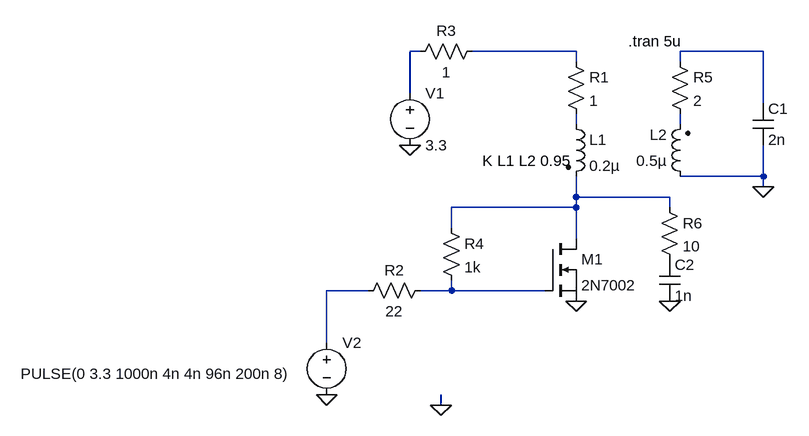
[diagram p0: schematic coupled-antenna-v1.asc]
coupled-antenna-v1.asc, the LTspice schematic file:
Version 4
SHEET 1 1060 752
WIRE 208 112 192 112
WIRE 448 112 288 112
WIRE 736 112 608 112
WIRE 448 128 448 112
WIRE 608 128 608 112
WIRE 192 176 192 112
WIRE 736 192 736 112
WIRE 448 224 448 208
WIRE 608 224 608 208
WIRE 736 304 736 256
WIRE 736 304 608 304
WIRE 736 320 736 304
WIRE 448 336 448 304
WIRE 592 336 448 336
WIRE 448 352 448 336
WIRE 448 352 256 352
WIRE 592 352 592 336
WIRE 256 384 256 352
WIRE 448 400 448 352
WIRE 128 480 64 480
WIRE 256 480 256 464
WIRE 256 480 208 480
WIRE 400 480 256 480
WIRE 64 560 64 480
WIRE 240 656 240 640
FLAG 192 256 0
FLAG 448 496 0
FLAG 64 640 0
FLAG 240 656 0
FLAG 736 320 0
FLAG 592 496 0
SYMBOL voltage 192 160 R0
SYMATTR InstName V1
SYMATTR Value 3.3
SYMBOL ind2 432 208 R0
SYMATTR InstName L1
SYMATTR Value 0.2µ
SYMATTR Type ind
SYMBOL ind2 624 320 R180
WINDOW 0 36 80 Left 2
WINDOW 3 36 40 Left 2
SYMATTR InstName L2
SYMATTR Value 0.5µ
SYMATTR Type ind
SYMBOL cap 720 192 R0
SYMATTR InstName C1
SYMATTR Value 2n
SYMBOL voltage 64 544 R0
WINDOW 3 -471 64 Left 2
SYMATTR Value PULSE(0 3.3 1000n 4n 4n 96n 200n 8)
SYMATTR InstName V2
SYMBOL res 432 112 R0
SYMATTR InstName R1
SYMATTR Value 1
SYMBOL nmos 400 400 R0
SYMATTR InstName M1
SYMATTR Value 2N7002
SYMBOL res 224 464 R90
WINDOW 0 0 56 VBottom 2
WINDOW 3 32 56 VTop 2
SYMATTR InstName R2
SYMATTR Value 22
SYMBOL res 304 96 R90
WINDOW 0 0 56 VBottom 2
WINDOW 3 32 56 VTop 2
SYMATTR InstName R3
SYMATTR Value 1
SYMBOL res 240 368 R0
SYMATTR InstName R4
SYMATTR Value 1k
SYMBOL res 592 112 R0
SYMATTR InstName R5
SYMATTR Value 2
SYMBOL cap 576 432 R0
SYMATTR InstName C2
SYMATTR Value 1n
SYMBOL res 576 336 R0
SYMATTR InstName R6
SYMATTR Value 10
TEXT 304 280 Left 2 !K L1 L2 0.95
TEXT 528 96 Left 2 !.tran 5u

The netlist it stands for:
* coupled-antenna-v1.asc
V1 N001 0 3.3
L1 N004 N006 0.2µ
L2 0 N005 0.5µ
C1 N003 0 2n
V2 N007 0 PULSE(0 3.3 1000n 4n 4n 96n 200n 8)
R1 N002 N004 1
M1 N006 N008 0 0 2N7002
R2 N008 N007 22
R3 N002 N001 1
R4 N006 N008 1k
R5 N003 N005 2
C2 P001 0 1n
R6 N006 P001 10
.model NMOS NMOS
.model PMOS PMOS
.lib standard.mos
K L1 L2 0.95
.tran 5u
.backanno
.end